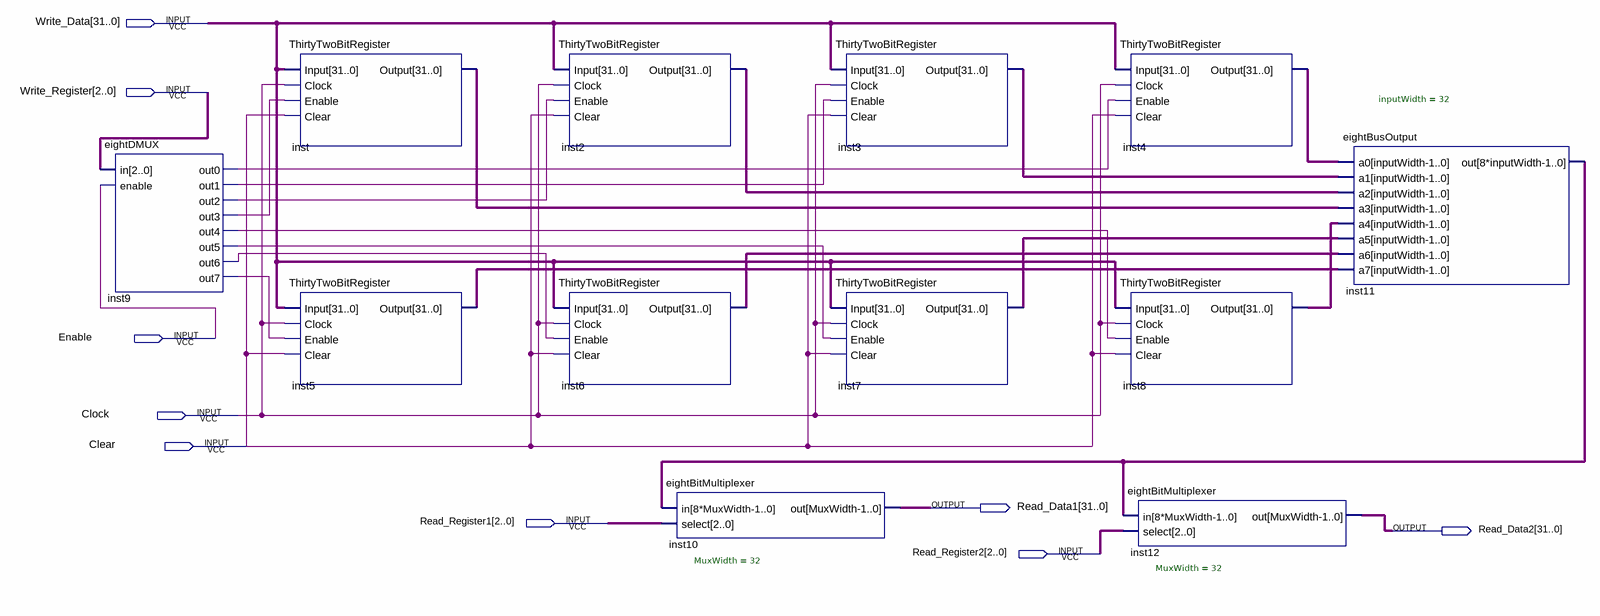
[diagram p0: schematic sheet]
// Quartus schematic EightbitRegisterContainer.bdf as structural Verilog: 12 symbols, 9 pins
module EightbitRegisterContainer (
  input  [31:0] Write_Data,
  input  [2:0] Write_Register,
  input  Enable,
  input  Clock,
  input  Clear,
  input  [2:0] Read_Register1,
  input  [2:0] Read_Register2,
  output [31:0] Read_Data1,
  output [31:0] Read_Data2
);

  wire inst9_out0, inst9_out1, inst9_out2, inst9_out3, inst9_out4, inst9_out5, inst9_out6, inst9_out7;
  wire [31:0] inst2_output, inst3_output, inst4_output, inst5_output, inst6_output, inst7_output,
       inst8_output, inst_output;
  wire [255:0] inst11_out;

  eightDMUX inst9 (
    .in(Write_Register), .enable(Enable), .out0(inst9_out0), .out1(inst9_out1), .out2(inst9_out2),
    .out3(inst9_out3), .out4(inst9_out4), .out5(inst9_out5), .out6(inst9_out6), .out7(inst9_out7));
  ThirtyTwoBitRegister inst (
    .Input(Write_Data), .Clock(Clock), .Enable(inst9_out3), .Clear(Clear), .Output(inst_output));
  ThirtyTwoBitRegister inst5 (
    .Input(Write_Data), .Clock(Clock), .Enable(inst9_out7), .Clear(Clear), .Output(inst5_output));
  ThirtyTwoBitRegister inst2 (
    .Input(Write_Data), .Clock(Clock), .Enable(inst9_out2), .Clear(Clear), .Output(inst2_output));
  ThirtyTwoBitRegister inst6 (
    .Input(Write_Data), .Clock(Clock), .Enable(inst9_out6), .Clear(Clear), .Output(inst6_output));
  eightBitMultiplexer #(.MuxWidth(32)) inst10 (.in(inst11_out), .select(Read_Register1), .out(Read_Data1));
  ThirtyTwoBitRegister inst3 (
    .Input(Write_Data), .Clock(Clock), .Enable(inst9_out1), .Clear(Clear), .Output(inst3_output));
  ThirtyTwoBitRegister inst7 (
    .Input(Write_Data), .Clock(Clock), .Enable(inst9_out5), .Clear(Clear), .Output(inst7_output));
  ThirtyTwoBitRegister inst4 (
    .Input(Write_Data), .Clock(Clock), .Enable(inst9_out0), .Clear(Clear), .Output(inst4_output));
  ThirtyTwoBitRegister inst8 (
    .Input(Write_Data), .Clock(Clock), .Enable(inst9_out4), .Clear(Clear), .Output(inst8_output));
  eightBitMultiplexer #(.MuxWidth(32)) inst12 (.in(inst11_out), .select(Read_Register2), .out(Read_Data2));
  eightBusOutput #(.inputWidth(32)) inst11 (
    .a0(inst4_output), .a1(inst3_output), .a2(inst2_output), .a3(inst_output), .a4(inst8_output),
    .a5(inst7_output), .a6(inst6_output), .a7(inst5_output), .out(inst11_out));
endmodule
